# Altium project 8.Circuit.PrjPcb
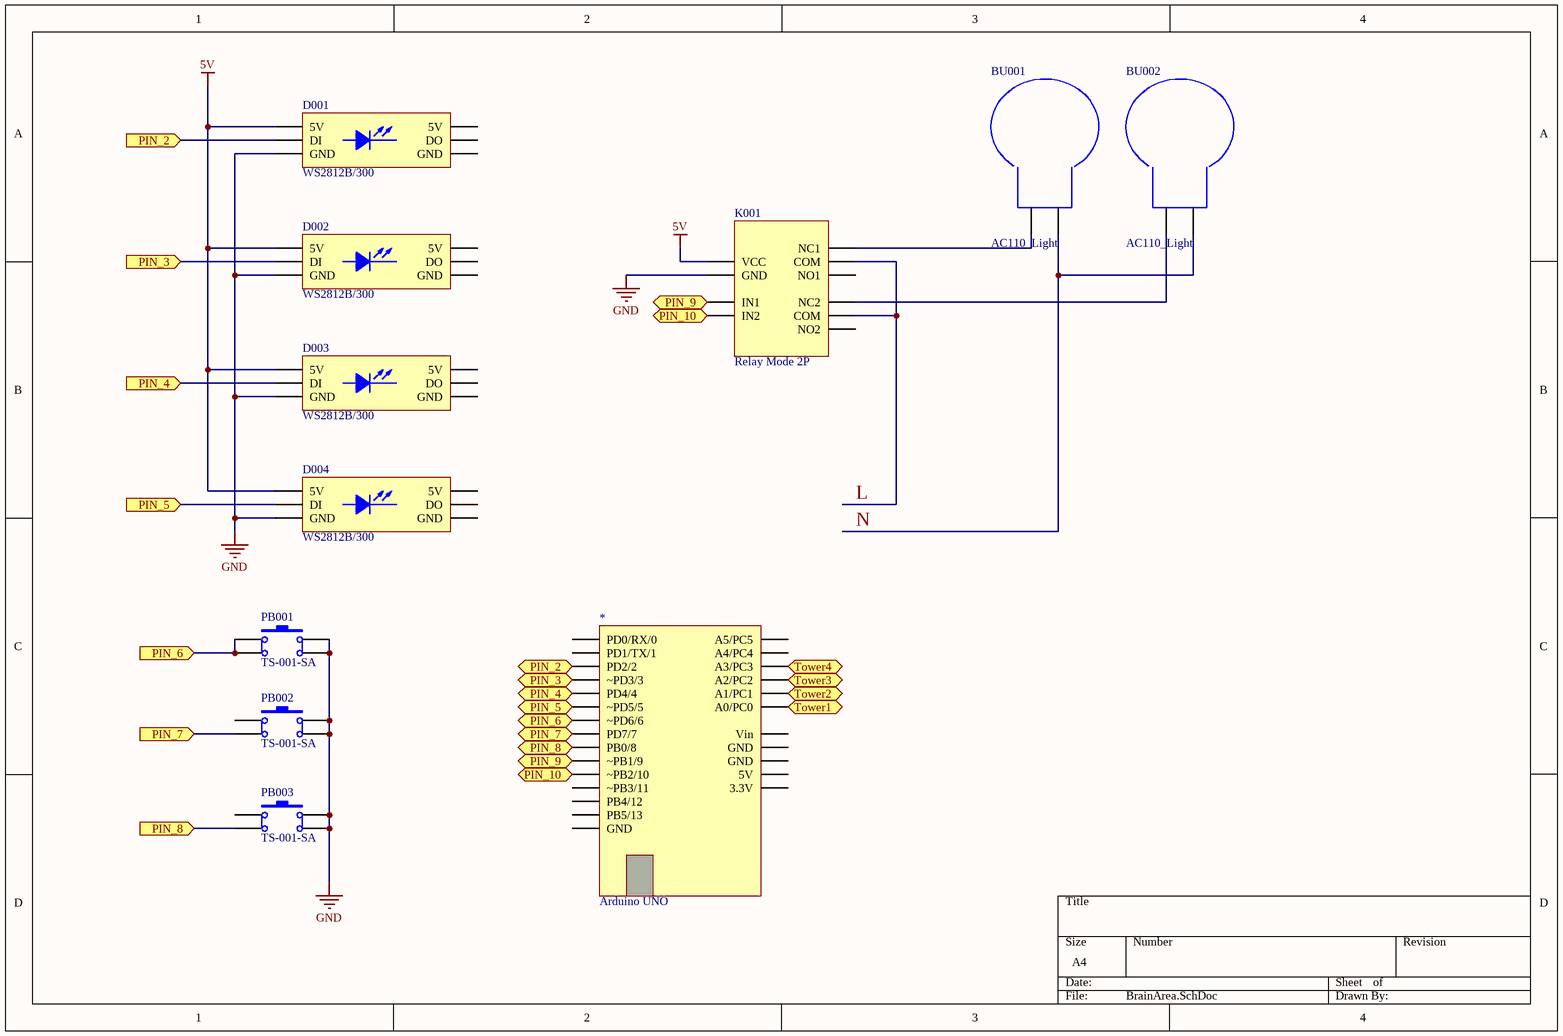
[diagram p0: BrainArea.SchDoc]
3 sheets, 30 parts. Net scope: flat (ports and power ports of the same name join across sheets).
Sheets:
  BrainArea.SchDoc
  Tower & AI.SchDoc
  Tower Area.SchDoc

## Sheet BrainArea.SchDoc
size A4

### Parts
(Parts that share a designator on the sheet are numbered #1, #2 ... from top to bottom, then left to right.)
*  Arduino UNO
BU001  AC110_Light
BU002  AC110_Light
D001  WS2812B/300
D002  WS2812B/300
D003  WS2812B/300
D004  WS2812B/300
K001  Relay Mode 2P
PB001  TS-001-SA
PB002  TS-001-SA
PB003#1  TS-001-SA

### Ports
PIN_2 (in), PIN_2 (out), PIN_3 (in), PIN_3 (out), PIN_4 (in), PIN_4 (out), PIN_5 (in), PIN_5 (out), PIN_6 (in), PIN_7 (in), PIN_8 (in), PIN_9 (in), PIN_9 (out), PIN_10 (in), PIN_10 (out), Tower1 (out), Tower2 (out), Tower3 (out), Tower4 (in)

### Nets
5V: D001.1(5V) D002.1(5V) D003.1(5V) D004.1(5V) K001.1(VCC)
GND: D001.3(GND) D002.3(GND) D003.3(GND) D004.3(GND) K001.2(GND) PB001.2 PB001.4 PB002.2 PB002.4 PB003#1.2 PB003#1.4
L: K001.5(COM) K001.8(COM)
N: BU001.2 BU002.2
Net*_28: *.28(PD2/2) D001.2(DI) ; port PIN_2
Net*_29: *.29(~PD3/3) D002.2(DI) ; port PIN_3
Net*_30: *.30(PD4/4) D003.2(DI) ; port PIN_4
Net*_31: *.31(~PD5/5) D004.2(DI) ; port PIN_5
Net*_32: *.32(~PD6/6) PB001.1 PB001.3 ; port PIN_6
Net*_33: *.33(PD7/7) PB002.3 ; port PIN_7
Net*_34: *.34(PB0/8) PB003#1.3 ; port PIN_8
Net*_35: *.35(~PB1/9) K001.3(IN1) ; port PIN_9
Net*_36: *.36(~PB2/10) K001.4(IN2) ; port PIN_10
Net*_43: *.43(A3/PC3) ; port Tower4
Net*_44: *.44(A2/PC2) ; port Tower3
Net*_45: *.45(A1/PC1) ; port Tower2
Net*_46: *.46(A0/PC0) ; port Tower1
NetBU001_1: BU001.1 K001.6(NC1)
NetBU002_1: BU002.1 K001.9(NC2)

Not connected (* = marked no-connect by the designer): * 26(PD0/RX/0) 27(PD1/TX/1) 37(~PB3/11) 38(PB4/12) 39(PB5/13) 40(GND) 41(A5/PC5) 42(A4/PC4) 47(Vin) 48(GND) 49(GND) 50(5V) 51(3.3V); D001 4(5V) 5(DO) 6(GND); D002 4(5V) 5(DO) 6(GND); D003 4(5V) 5(DO) 6(GND); D004 4(5V) 5(DO) 6(GND); K001 7(NO1) 10(NO2); PB002 1; PB003#1 1

### Library data of the parts
D001 D002 D003 D004 = WS2812B: LED strip; Voltage: 5V; Number: 300
K001 = Relay Mode 2P: Input Voltage: DC5V; Controll Voltage: AC110; Chanel: 2
PB001 PB002 PB003#1 = SW-PB: Push Buttom

## Sheet Tower & AI.SchDoc
size A4
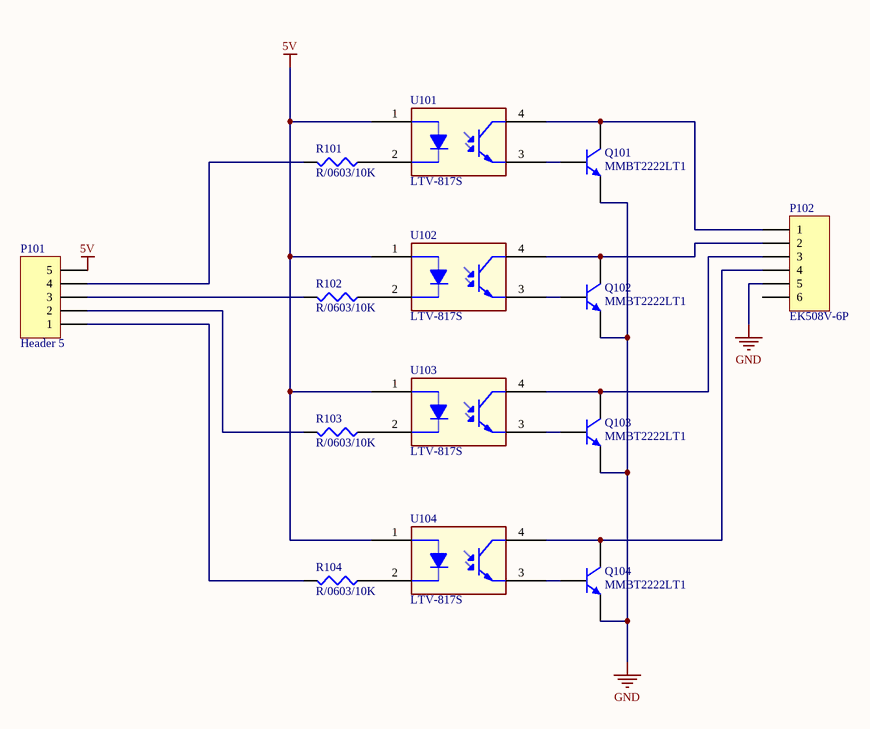
[diagram p1: Tower & AI.SchDoc]

### Parts
(Parts that share a designator on the sheet are numbered #1, #2 ... from top to bottom, then left to right.)
P101#1  Header 5  [HDR1X5]
P102  EK508V-6P  [EK508V-6P]
Q101  MMBT2222LT1  [SO-G3/C2.25]
Q102  MMBT2222LT1  [SO-G3/C2.25]
Q103  MMBT2222LT1  [SO-G3/C2.25]
Q104  MMBT2222LT1  [SO-G3/C2.25]
R101  R/0603/10K  [R_SMD_0603]
R102  R/0603/10K  [R_SMD_0603]
R103  R/0603/10K  [R_SMD_0603]
R104  R/0603/10K  [R_SMD_0603]
U101  LTV-817S  [U_SMD4_PC817]
U102  LTV-817S  [U_SMD4_PC817]
U103  LTV-817S  [U_SMD4_PC817]
U104  LTV-817S  [U_SMD4_PC817]

### Nets
5V: P101#1.5 U101.1(A) U102.1(A) U103.1(A) U104.1(A)
GND: P102.5 Q101.2(E) Q102.2(E) Q103.2(E) Q104.2(E)
NetP101#1_1: P101#1.1 R104.2
NetP101#1_2: P101#1.2 R103.2
NetP101#1_3: P101#1.3 R102.2
NetP101#1_4: P101#1.4 R101.2
NetP102_1: P102.1 Q101.3(C) U101.4(C)
NetP102_2: P102.2 Q102.3(C) U102.4(C)
NetP102_3: P102.3 Q103.3(C) U103.4(C)
NetP102_4: P102.4 Q104.3(C) U104.4(C)
NetQ101_1: Q101.1(B) U101.3(E)
NetQ102_1: Q102.1(B) U102.3(E)
NetQ103_1: Q103.1(B) U103.3(E)
NetQ104_1: Q104.1(B) U104.3(E)
NetR101_1: R101.1 U101.2(C)
NetR102_1: R102.1 U102.2(C)
NetR103_1: R103.1 U103.2(C)
NetR104_1: R104.1 U104.2(C)

Not connected (* = marked no-connect by the designer): P102 6

### Library data of the parts
P101#1 = Header 5: Header, 5-Pin; LatestRevisionDate: 17-Jul-2002; LatestRevisionNote: Re-released for DXP Platform.; Publisher: Altium Limited
Q101-Q104 = MMBT2222LT1: General Purpose Transistors  NPN Silicon
R101-R104 = Res: Resistor; Value: 10K
U101-U104 = LTV-817S: Single Photocoupler 80kHz

## Sheet Tower Area.SchDoc
size A4
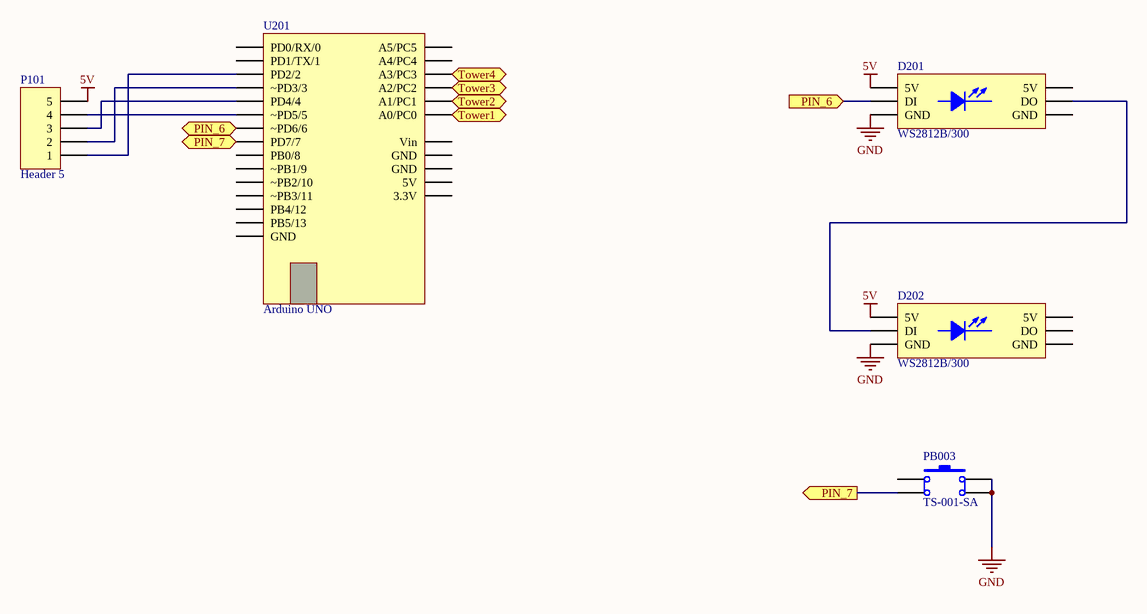
[diagram p2: Tower Area.SchDoc]

### Parts
(Parts that share a designator on the sheet are numbered #1, #2 ... from top to bottom, then left to right.)
D201  WS2812B/300
D202  WS2812B/300
P101#2  Header 5  [HDR1X5]
PB003#2  TS-001-SA
U201  Arduino UNO

### Ports
PIN_6 (in), PIN_6 (out), PIN_7 (in), PIN_7 (out), Tower1 (in), Tower2 (in), Tower3 (in), Tower4 (out)

### Nets
5V: D201.1(5V) D202.1(5V) P101#2.5
GND: D201.3(GND) D202.3(GND) PB003#2.2 PB003#2.4
Net*_32: D201.2(DI) U201.32(~PD6/6) ; port PIN_6
Net*_33: PB003#2.3 U201.33(PD7/7) ; port PIN_7
Net*_43: U201.43(A3/PC3) ; port Tower4
Net*_44: U201.44(A2/PC2) ; port Tower3
Net*_45: U201.45(A1/PC1) ; port Tower2
Net*_46: U201.46(A0/PC0) ; port Tower1
NetD201_5: D201.5(DO) D202.2(DI)
NetP101#2_1: P101#2.1 U201.28(PD2/2)
NetP101#2_2: P101#2.2 U201.29(~PD3/3)
NetP101#2_3: P101#2.3 U201.30(PD4/4)
NetP101#2_4: P101#2.4 U201.31(~PD5/5)

Not connected (* = marked no-connect by the designer): D201 4(5V) 6(GND); D202 4(5V) 5(DO) 6(GND); PB003#2 1; U201 26(PD0/RX/0) 27(PD1/TX/1) 34(PB0/8) 35(~PB1/9) 36(~PB2/10) 37(~PB3/11) 38(PB4/12) 39(PB5/13) 40(GND) 41(A5/PC5) 42(A4/PC4) 47(Vin) 48(GND) 49(GND) 50(5V) 51(3.3V)

### Library data of the parts
D201 D202 = WS2812B: LED strip; Voltage: 5V; Number: 300
P101#2 = Header 5: Header, 5-Pin; LatestRevisionDate: 17-Jul-2002; LatestRevisionNote: Re-released for DXP Platform.; Publisher: Altium Limited
PB003#2 = SW-PB: Push Buttom

## Nets that join several sheets
5V: BrainArea (5 pins), Tower & AI (5 pins), Tower Area (D201.1 D202.1 P101#2.5)
GND: BrainArea (11 pins), Tower & AI (5 pins), Tower Area (D201.3 D202.3 PB003#2.2 PB003#2.4)
Net*_32: BrainArea (*.32 PB001.1 PB001.3), Tower Area (D201.2 U201.32)
Net*_33: BrainArea (*.33 PB002.3), Tower Area (PB003#2.3 U201.33)
Net*_43: BrainArea (*.43), Tower Area (U201.43)
Net*_44: BrainArea (*.44), Tower Area (U201.44)
Net*_45: BrainArea (*.45), Tower Area (U201.45)
Net*_46: BrainArea (*.46), Tower Area (U201.46)